# Altium schematic sheet Sheet1.SchDoc
size B; SheetNumber: 1; SheetTotal: 1
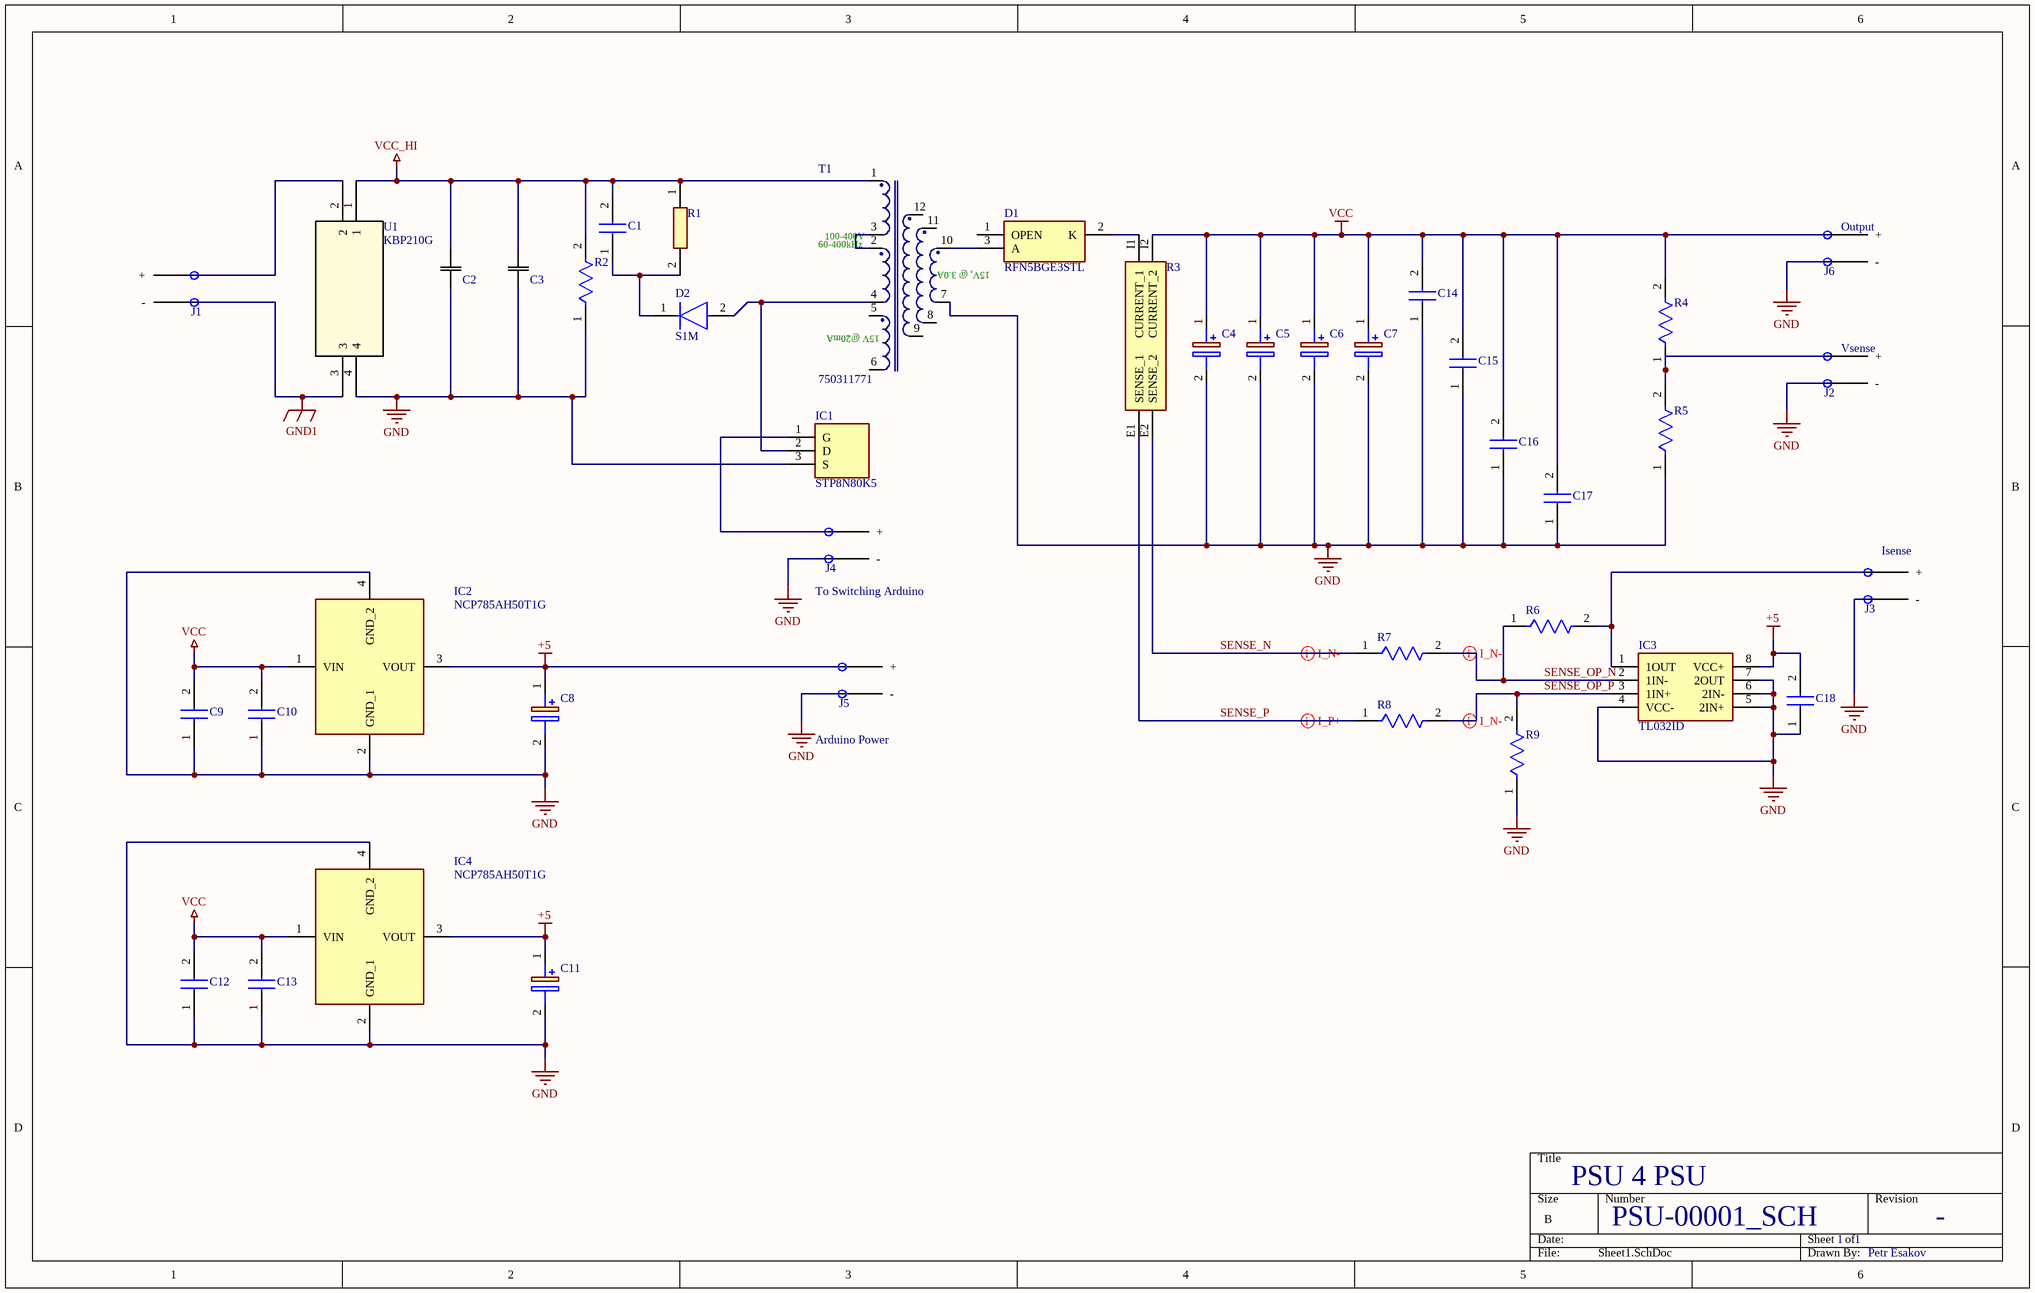
[diagram p0: Sheet1.SchDoc]

## Parts
C1  C2220C105K2RACTU  [C2220]  (value not drawn)
C2  500HXW100MEFR18X45  [CAP_HXW_18X45_RUB]  (value not drawn)
C3  500HXW100MEFR18X45  [CAP_HXW_18X45_RUB]  (value not drawn)
C4  EGXF630ELL511MK25S  [CAPPRD500W60D1275H2650]  (value not drawn)
C5  EGXF630ELL511MK25S  [CAPPRD500W60D1275H2650]  (value not drawn)
C6  EGXF630ELL511MK25S  [CAPPRD500W60D1275H2650]  (value not drawn)
C7  EGXF630ELL511MK25S  [CAPPRD500W60D1275H2650]  (value not drawn)
C8  MAL202139229E3  [CAPPA4610W80L1850D690]  (value not drawn)
C9  ECW-FD2J105J  [ECWFD2J105J]  (value not drawn)
C10  ECW-FD2J105J  [ECWFD2J105J]  (value not drawn)
C11  MAL202139229E3  [CAPPA4610W80L1850D690]  (value not drawn)
C12  ECW-FD2J105J  [ECWFD2J105J]  (value not drawn)
C13  ECW-FD2J105J  [ECWFD2J105J]  (value not drawn)
C14  K104K15X7RF5TH5  [K104K15X7RF5TH5]  (value not drawn)
C15  K104K15X7RF5TH5  [K104K15X7RF5TH5]  (value not drawn)
C16  K104K15X7RF5TH5  [K104K15X7RF5TH5]  (value not drawn)
C17  K104K15X7RF5TH5  [K104K15X7RF5TH5]  (value not drawn)
C18  K104K15X7RF5TH5  [K104K15X7RF5TH5]  (value not drawn)
D1  RFN5BGE3STL  [RD3P175SNFRATL]
D2  S1M  [FP-403AE-MFG]
IC1  STP8N80K5  [TO255P460X1020X2008-3P]
IC2  NCP785AH50T1G  [NCP785AH50T1G]
IC3  TL032ID  [SOIC127P600X175-8N]
IC4  NCP785AH50T1G  [NCP785AH50T1G]
J1  Component_1  [PCBComponent_1]  (value not drawn)
J2  Component_1  [PCBComponent_1]  (value not drawn)
J3  Component_1  [PCBComponent_1]  (value not drawn)
J4  Component_1  [PCBComponent_1]  (value not drawn)
J5  Component_1  [PCBComponent_1]  (value not drawn)
J6  Component_1  [PCBComponent_1]  (value not drawn)
R1  MRS25000C7500FRP00  [RESAD1650W60L650D250]  (value not drawn)
R2  CRCW251210K0JNEG  [FP-CRCW2512-e3-IPC_A]  (value not drawn)
R3  Y14870R10000B9R  [Y14870R10000B9R]  (value not drawn)
R4  CR0805-FX-1003ELF  [FP-CR0805-IPC_B]  (value not drawn)
R5  CRCW080520K0FKTA  [FP-CRCW0805-e3-IPC_B]  (value not drawn)
R6  CRCW0805330KFKEA  [FP-CRCW0805-e3-MFG]  (value not drawn)
R7  CRCW080520K0FKEB  [FP-CRCW0805-e3-IPC_B]  (value not drawn)
R8  CRCW080520K0FKEB  [FP-CRCW0805-e3-IPC_B]  (value not drawn)
R9  CRCW0805330KFKEA  [FP-CRCW0805-e3-MFG]  (value not drawn)
T1  750311771  [EFD25]
U1  KBP210G  [TO_P2005G_DIO]

## Nets
+5: C8.1(+) C11.1(+) C18.2 IC2.3(VOUT) IC3.8(VCC+) IC4.3(VOUT) J5.0(+)
GND: C2.1 C3.1 C4.2(-) C5.2(-) C6.2(-) C7.2(-) C8.2(-) C9.1 C10.1 C11.2(-) C12.1 C13.1 C14.1 C15.1 C16.1 C17.1 C18.1 IC1.3(S) IC2.2(GND_1) IC2.4(GND_2) IC3.4(VCC-) IC3.5(2IN+) IC3.6(2IN-) IC3.7(2OUT) IC4.2(GND_1) IC4.4(GND_2) J2.1(-) J3.1(-) J4.1(-) J5.1(-) J6.1(-) R2.1 R5.1 R9.1 T1.7 U1.4
GND1: J1.1(-) U1.3
VCC: C4.1(+) C5.1(+) C6.1(+) C7.1(+) C9.2 C10.2 C12.2 C13.2 C14.2 C15.2 C16.2 C17.2 IC2.1(VIN) IC4.1(VIN) J6.0(+) R3.I2(CURRENT_2) R4.2
VCC_HI: C1.2 C2.2 C3.2 R1.1 R2.2 T1.1 U1.1
SENSE_N: R3.E2(SENSE_2) R7.1
SENSE_OP_N: IC3.2(1IN-) R6.1 R7.2
SENSE_OP_P: IC3.3(1IN+) R8.2 R9.2
SENSE_P: R3.E1(SENSE_1) R8.1
NetC1_1: C1.1 D2.1(C) R1.2
NetD1_2: D1.2(K) R3.I1(CURRENT_1)
NetD1_3: D1.3(A) T1.10
NetD2_2: D2.2(A) IC1.2(D) T1.4
NetIC1_1: IC1.1(G) J4.0(+)
NetIC3_1: IC3.1(1OUT) J3.0(+) R6.2
NetJ1_0: J1.0(+) U1.2
NetJ2_0: J2.0(+) R4.1 R5.2
NetT1_2: T1.2 T1.3

Not connected (* = marked no-connect by the designer): D1 1(OPEN); T1 5 6 8 9 11 12

## Layout directives
differential pair: SENSE_N, SENSE_OP_N, SENSE_OP_P, SENSE_P

## Notes on the sheet
- (near J6) Output
- (near J2) Vsense
- (near J3) Isense
- (near J4) To Switching Arduino
- (near J5) Arduino Power
- PSU 4 PSU
- PSU-00001_SCH
- 1
- -
- Petr Esakov
- (in symbol CMP-1360-00010-1) 60-400kHz; 15V, @ 3.0A; 15V @20mA

## Library data of the parts
C1 = C2220C105K2RACTU: Capacitor; Manufacturer_Name: KEMET; Datasheet Link: https://content.kemet.com/datasheets/KEM_C1002_X7R_SMD.pdf; Height: 2.2mm; Manufacturer_Part_Number: C2220C105K2RACTU; Supplier 1: Mouser; Supplier Part Number 1: 80-C2220C105K2RACTU
C2 C3 = 500HXW100MEFR18X45: No Description Available; Mfr_Name: Rubycon; Digi-Key_Part_Number_1: 1189-4253-ND; Supplier 1: Mouser; Supplier Part Number 1: 232-0HXW100MEFR18X45
C4-C7 = EGXF630ELL511MK25S: Capacitor Polarised; Manufacturer_Name: Chemi-Con; Datasheet Link: https://www.mouser.com/datasheet/2/420/United-Chemi-Con-1016798.pdf; Height: 26.5mm; Manufacturer_Part_Number: EGXF630ELL511MK25S; Mouser Part Number: 661-EGXF630ELL511MK2; Mouser Price/Stock: https://www.mouser.co.uk/ProductDetail/United-Chemi-Con/EGXF630ELL511MK25S?qs=8BXZADTIn4FuMrtucNpwhg%3D%3D
  C4: Supplier 1: Mouser; Supplier Part Number 1: 661-EGXF630ELL511MK2
C8 C11 = MAL202139229E3: Capacitor Polarised; Manufacturer_Name: Vishay; Datasheet Link: https://componentsearchengine.com/Datasheets/2/MAL202139229E3.pdf; Manufacturer_Part_Number: MAL202139229E3; Mouser Part Number: 594-2222-021-39229; Mouser Price/Stock: https://www.mouser.co.uk/ProductDetail/Vishay-BC-Components/MAL202139229E3?qs=KQJA%252BRRrFWe8KeR1ZcOE%2FA%3D%3D; Arrow Part Number: MAL202139229E3; Arrow Price/Stock: https://www.arrow.com/en/products/mal202139229e3/vishay?region=nac
  C8: Supplier 1: Mouser; Supplier Part Number 1: 594-2222-021-39229
C9 C10 C12 C13 = ECW-FD2J105J: Capacitor; Manufacturer_Name: Panasonic; Datasheet Link: https://industrial.panasonic.com/cdbs/www-data/pdf/RDI0000/ABD0000C255.pdf; Height: 15mm; Manufacturer_Part_Number: ECW-FD2J105J; Mouser Part Number: 667-ECW-FD2J105J; Mouser Price/Stock: https://www.mouser.com/Search/Refine.aspx?Keyword=667-ECW-FD2J105J; Arrow Part Number: ECW-FD2J105J; Arrow Price/Stock: https://www.arrow.com/en/products/ecw-fd2j105j/panasonic
  C9: Supplier 1: Mouser; Supplier Part Number 1: 667-ECW-FD2J105J
C14-C18 = K104K15X7RF5TH5: Capacitor; Manufacturer_Name: Vishay; Datasheet Link: https://www.vishay.com/docs/45171/kseries.pdf; Height: 6.6mm; Manufacturer_Part_Number: K104K15X7RF5TH5; Mouser Part Number: 594-K104K15X7RF5TH5; Mouser Price/Stock: https://www.mouser.co.uk/ProductDetail/Vishay-BC-Components/K104K15X7RF5TH5?qs=CuWZN%2F5Vbiofhf%252BuZNGw%2Fg%3D%3D; Arrow Part Number: K104K15X7RF5TH5; Arrow Price/Stock: https://www.arrow.com/en/products/k104k15x7rf5th5/vishay?region=europe
  C14: Supplier 1: Mouser; Supplier Part Number 1: 594-K104K15X7RF5TH5
D1 = RFN5BGE3STL: Diode; Manufacturer_Name: ROHM Semiconductor; Datasheet Link: https://fscdn.rohm.com/en/products/databook/datasheet/discrete/diode/fast_recovery/rfn5bge3s-e.pdf; Manufacturer_Part_Number: RFN5BGE3STL; Mouser Part Number: 755-RFN5BGE3STL; Mouser Price/Stock: https://www.mouser.co.uk/ProductDetail/ROHM-Semiconductor/RFN5BGE3STL?qs=gTYE2QTfZfS830v3%252BAHYoA%3D%3D; Supplier 1: Mouser; Supplier Part Number 1: 755-RFN5BGE3STL
D2 = CMP-2000-04942-3: DIODE GEN PURP 1KV 1A SMA; Element Configuration: Single; Peak Non-Repetitive Surge Current: 30A; Polarity: Standard; Max Surge Current: 40A; Forward Voltage: 1.1V; Capacitance: 12pF; Power Dissipation: 1.4W; Reverse Recovery Time: 1.8us; Peak Reverse Current: 1uA; Recovery Time: 1800ns; Contact Plating: Tin; Termination: SMD/SMT; Forward Current: 1A; Case/Package: SMA; Package Quantity: 1; Length: 4.75mm; Lead Free: Lead Free; Max Reverse Voltage (DC): 1kV; Reverse Voltage: 1kV; Height: 2.2mm; Current Rating: 1A; Number of Pins: 2; Max Operating Temperature: 150°C; Mount: Surface Mount; Max Forward Surge Current (Ifsm): 30A; Width: 5.28mm; Max Repetitive Reverse Voltage (Vrrm): 1kV; Current: 1A; Voltage: 1kV; Voltage Rating (DC): 1kV; REACH SVHC: No SVHC; Min Operating Temperature: -55°C; Packaging: Tape and Reel; Output Current: 1A; Radiation Hardening: No; Average Rectified Current: 1A
IC1 = STP8N80K5: Integrated Circuit; Manufacturer_Name: STMicroelectronics; Datasheet Link: https://www.st.com/resource/en/datasheet/stp8n80k5.pdf; Height: 4.6mm; Manufacturer_Part_Number: STP8N80K5; Mouser Part Number: 511-STP8N80K5; Mouser Price/Stock: https://www.mouser.co.uk/ProductDetail/STMicroelectronics/STP8N80K5?qs=RzIIFhRKomv5IC85NofN1A%3D%3D; Supplier 1: Mouser; Supplier Part Number 1: 511-STU8N80K5
IC2 IC4 = NCP785AH50T1G: Integrated Circuit; Manufacturer_Name: onsemi; Datasheet Link: http://www.mouser.com/ds/2/308/NCP785A-D-532012.pdf; Height: 1.6mm; Manufacturer_Part_Number: NCP785AH50T1G; Mouser Part Number: 863-NCP785AH50T1G; Mouser Price/Stock: https://www.mouser.co.uk/ProductDetail/onsemi/NCP785AH50T1G?qs=k6dkFvHqcvALNdsDcRACbw%3D%3D; Arrow Part Number: NCP785AH50T1G; Arrow Price/Stock: https://www.arrow.com/en/products/ncp785ah50t1g/on-semiconductor?region=nac; Supplier 1: Mouser; Supplier Part Number 1: 863-NCP785AH50T1G
IC3 = TL032ID: Integrated Circuit; Manufacturer_Name: Texas Instruments; Datasheet Link: http://www.ti.com/lit/ds/symlink/tl032.pdf; Height: 1.75mm; Manufacturer_Part_Number: TL032ID; Mouser Part Number: 595-TL032ID; Mouser Price/Stock: https://www.mouser.co.uk/ProductDetail/Texas-Instruments/TL032ID?qs=RZS%252BpEsUn7pGfb6fvXIvLw%3D%3D; Arrow Part Number: TL032ID; Arrow Price/Stock: https://www.arrow.com/en/products/tl032id/texas-instruments; Supplier 1: Mouser; Supplier Part Number 1: 595-TL032ID
R1 = MRS25000C7500FRP00: Resistor; Manufacturer_Name: Vishay; Datasheet Link: http://www.vishay.com/docs/28724/mrs16m25.pdf; Manufacturer_Part_Number: MRS25000C7500FRP00; Supplier 1: Mouser; Supplier Part Number 1: 594-MRS25000C7500FRP
R2 = CMP-02407-002758-1: RES Thick Film, 10kΩ, 5%, 1W, 200ppm/°C, 2512; Resistance: 10kR; Voltage Rating: 500V; Termination: SMD/SMT; Weight: 0.001429oz; Number of Terminations: 2; Package Quantity: 1; Case/Package: 2512; Length: 6.3mm; Temperature Coefficient: 200ppm/°C; Packaging: Tape and Reel; Voltage Rating (DC): 500V; Case Code (Imperial): 2512; Max Operating Temperature: 155°C; Number of Pins: 2; Height: 0.028inch; Military Standard: Not; Lead Free: Lead Free; Min Operating Temperature: -55°C; Features: Automotive AEC-Q200; Contact Plating: Tin; Depth: 3.15mm; Mount: Surface Mount; REACH SVHC: No SVHC; Composition: Thick Film; Radiation Hardening: No; Max Power Dissipation: 1W; Case Code (Metric): 6432; Power Rating: 1W; Width: 0.124inch; Tolerance: 5%
R3 = Y14870R10000B9R: Resistor; Manufacturer_Name: Vishay; Datasheet Link: http://uk.rs-online.com/web/p/products/6841649; Height: 0.635mm; Manufacturer_Part_Number: Y14870R10000B9R; Mouser Part Number: 71-CSM25120R1000BST; Mouser Price/Stock: https://www.mouser.co.uk/ProductDetail/Vishay-Precision-Group-Foil-Resistors/Y14870R10000B9R?qs=eqe8eff%252BweTiXYXyeP50BA%3D%3D; Arrow Part Number: Y14870R10000B9R; Arrow Price/Stock: https://www.arrow.com/en/products/y14870r10000b9r/vishay-precision-group?region=nac; Supplier 1: Mouser; Supplier Part Number 1: 71-CSM25120R1000BST
R4 = CMP-1013-00736-2: Thick Film Chip Resistors 0805 100kΩ 0.125W 1% 100ppm/°C; Max Power Dissipation: 125mW; Resistance: 100kR; Voltage Rating: 150V; Voltage Rating (DC): 100V; Case Code (Imperial): 0805; Tolerance: 1%; Package Quantity: 5000; Temperature Coefficient: 100ppm/°C; Thickness: 508um; Packaging: Tape and Reel; Radiation Hardening: No; Number of Terminations: 2; Features: Moisture Resistant; Power Rating: 125mW; Case Code (Metric): 2012; Termination: SMD/SMT; Height: 0.5mm; Min Operating Temperature: -55°C; Length: 2mm; Max Operating Temperature: 155°C; Case/Package: 0805; Depth: 1.25mm; Contact Plating: Tin; Mount: Surface Mount; Composition: Thick Film; REACH SVHC: No SVHC; Width: 1.25mm; Number of Pins: 2
R5 R7 R8 = CMP-2001-04226-2: RES Thick Film, 20kΩ, 1%, 0.125W, 100ppm/°C, 0805; Max Power Dissipation: 125mW; Resistance: 20kR; Voltage Rating: 150V; Number of Pins: 2; Case Code (Imperial): 0805; Number of Terminations: 2; Max Operating Temperature: 155°C; Case Code (Metric): 2012; Tolerance: 1%; Composition: Thick Film; Temperature Coefficient: 100ppm/°C; Min Operating Temperature: -55°C; Package Quantity: 10000; Length: 0.079inch; Width: 0.049inch; Voltage Rating (DC): 150V; Power Rating: 125mW; Packaging: Tape and Reel; Case/Package: 0805; Features: Automotive AEC-Q200; Lead Free: Lead Free; Height: 0.02inch; Weight: 0.000194oz
R6 R9 = CMP-2001-03821-2: RES Thick Film, 330kΩ, 1%, 0.125W, 100ppm/°C, 0805; Power Rating: 125mW; Resistance: 330kR; Voltage Rating (DC): 150V; Case Code (Metric): 2012; Contact Plating: Tin; Composition: Thick Film; Length: 2mm; Radiation Hardening: No; Height: 0.45mm; Max Operating Temperature: 155°C; Lead Free: Lead Free; Packaging: Tape and Reel; Depth: 1.25mm; Tolerance: 1%; Width: 1.25mm; Termination: SMD/SMT; Case Code (Imperial): 0805; Case/Package: 0805; Voltage Rating: 150V; Weight: 0.000194oz; Package Quantity: 5000; Temperature Coefficient: 100ppm/°C; Military Standard: Not; Min Operating Temperature: -55°C
T1 = CMP-1360-00010-1: Flyback Transformer suitable or LT3573/ LT3574/ LT3575/ LT3748 WE-FB, Ui=100-400V; Manufacturer: Wuerth Elektronik; PackageReference: EFD25; ComponentLink1URL: http://www.we-online.com; ComponentLink1Description: Manufacturer URL; ComponentLink2URL: http://katalog.we-online.de/pbs/datasheet/750311771.pdf; PartNumber: 750311771; ComponentLink2Description: Datasheet; Ui: 100-400V
U1 = KBP210G: No Description Available; Mfr_Name: Diodes Inc; Digi-Key_Part_Number_4: KBP210GGS-ND; Digi-Key_Part_Number_3: 2796-KBP210G-ND; Digi-Key_Part_Number_1: KBP210GDI-ND; Digi-Key_Part_Number_2: 2721-KBP210G-ND; RefDes: RefDes; Type: Type; Supplier 1: Mouser; Supplier Part Number 1: 621-KBP210G